# EAGLE design OSD Mixer (EAGLE 9.6.2)
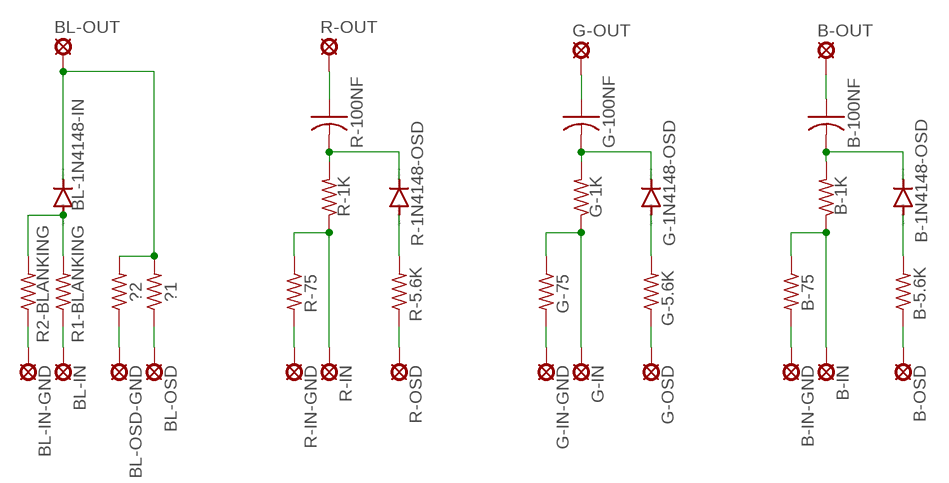
[diagram p0: schematic, sheet 1]

## Parts
?1  R-US_0204/2V  [0204V]
?2  R-US_0204/2V  [0204V]
B-1K  R-US_0204/2V  [0204V]
B-1N4148-OSD  1N4148DO35-7  [DO35-7]
B-5.6K  R-US_0204/2V  [0204V]
B-75  R-US_0204/2V  [0204V]
B-100NF  C-US025-024X044  [C025-024X044]
B-IN  SE14  [SE14]
B-IN-GND  SE14  [SE14]
B-OSD  SE14  [SE14]
B-OUT  SE14  [SE14]
BL-1N4148-IN  1N4148DO35-7  [DO35-7]
BL-IN  SE14  [SE14]
BL-IN-GND  SE14  [SE14]
BL-OSD  SE14  [SE14]
BL-OSD-GND  SE14  [SE14]
BL-OUT  SE14  [SE14]
G-1K  R-US_0204/2V  [0204V]
G-1N4148-OSD  1N4148DO35-7  [DO35-7]
G-5.6K  R-US_0204/2V  [0204V]
G-75  R-US_0204/2V  [0204V]
G-100NF  C-US025-024X044  [C025-024X044]
G-IN  SE14  [SE14]
G-IN-GND  SE14  [SE14]
G-OSD  SE14  [SE14]
G-OUT  SE14  [SE14]
R1-BLANKING  R-US_0204/2V  [0204V]
R2-BLANKING  R-US_0204/2V  [0204V]
R-1K  R-US_0204/2V  [0204V]
R-1N4148-OSD  1N4148DO35-7  [DO35-7]
R-5.6K  R-US_0204/2V  [0204V]
R-75  R-US_0204/2V  [0204V]
R-100NF  C-US025-024X044  [C025-024X044]
R-IN  SE14  [SE14]
R-IN-GND  SE14  [SE14]
R-OSD  SE14  [SE14]
R-OUT  SE14  [SE14]

## Nets
N$1: G-100NF.1 G-OUT.MP
N$2: BL-IN-GND.MP R2-BLANKING.1
N$3: G-1K.2 G-1N4148-OSD.C G-100NF.2
N$4: G-75.2 G-IN-GND.MP
N$5: G-1K.1 G-75.1 G-IN.MP
N$6: G-5.6K.1 G-OSD.MP
N$7: G-1N4148-OSD.A G-5.6K.2
N$8: R-100NF.1 R-OUT.MP
N$10: R-75.2 R-IN-GND.MP
N$11: BL-IN.MP R1-BLANKING.1
N$12: ?2.1 BL-OSD-GND.MP
N$13: ?1.1 BL-OSD.MP
N$14: R-1K.1 R-75.1 R-IN.MP
N$15: R-5.6K.1 R-OSD.MP
N$16: R-1N4148-OSD.A R-5.6K.2
N$17: BL-1N4148-IN.A R1-BLANKING.2 R2-BLANKING.2
N$18: B-75.2 B-IN-GND.MP
N$19: B-1K.1 B-75.1 B-IN.MP
N$20: B-5.6K.1 B-OSD.MP
N$21: ?1.2 ?2.2 BL-1N4148-IN.C BL-OUT.MP
N$22: B-1N4148-OSD.A B-5.6K.2
N$23: B-1K.2 B-1N4148-OSD.C B-100NF.2
N$24: B-100NF.1 B-OUT.MP
N$25: R-1K.2 R-1N4148-OSD.C R-100NF.2

## Library data of the parts
?1 ?2 B-1K B-5.6K B-75 G-1K G-5.6K G-75 R1-BLANKING R2-BLANKING R-1K R-5.6K R-75 = rcl:R-US_: RESISTOR, American symbol; SPICEPREFIX: R
B-1N4148-OSD BL-1N4148-IN G-1N4148-OSD R-1N4148-OSD = diode:1N4148: DIODE high speed (Philips)
B-100NF G-100NF R-100NF = rcl:C-US: CAPACITOR, American symbol; SPICEPREFIX: C
B-IN B-IN-GND B-OSD B-OUT BL-IN BL-IN-GND BL-OSD BL-OSD-GND BL-OUT G-IN G-IN-GND G-OSD G-OUT R-IN R-IN-GND R-OSD R-OUT = solpad:SE14: SOLDER PAD E1553, drill 1,4mm, distributor Buerklin, 07F820

## Board
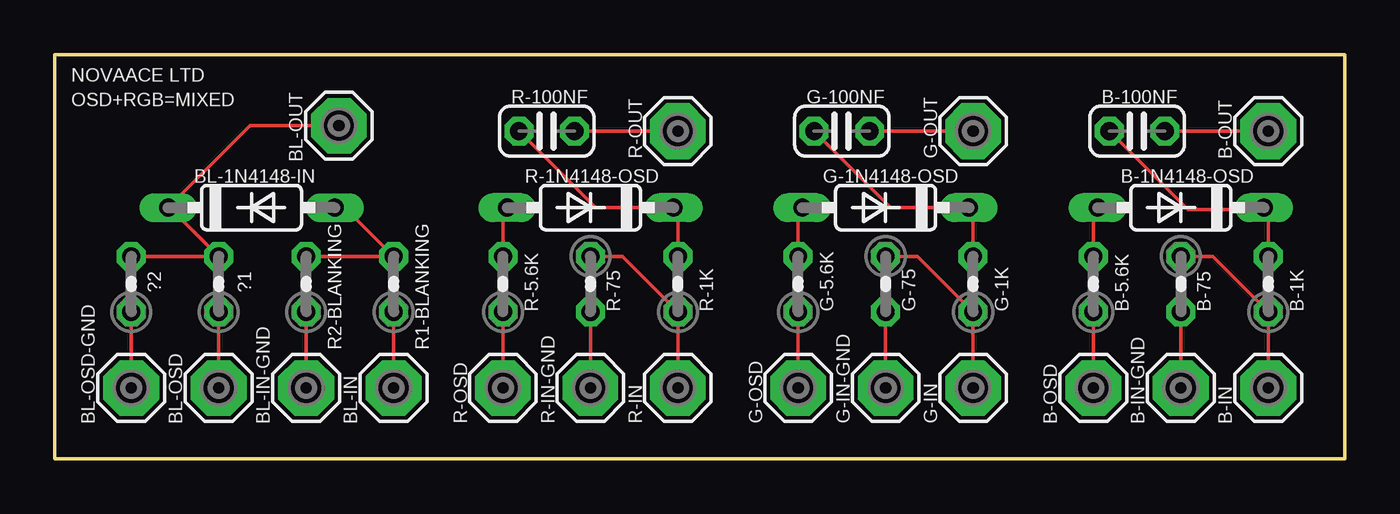
[diagram p1: board, top side]

Size 59 x 18.5 mm. Coordinates in mm from the lower left corner, seen from the top.
Outline: 0,0 0,18.5 59,18.5 59,0 0,0
Copper layers (1*16): Top 0.035mm / dielectric 1.5mm / Bottom 0.035mm
Design rules "default": minimum track width 6mil, minimum drill 0.35mm, track to track 6mil, track to pad 6mil, pad to pad 6mil, via to via 6mil, smd to smd 6mil, copper to edge 40mil, drill to drill 6mil, minimum pad ring 10mil, minimum via ring 8mil, stop-mask expansion 4mil, vias tented up to drill 0mil, thermal gap 10mil

### Footprints (pad centres in the part's own frame; a part is rotated, then mirrored left to right if it is on the bottom)
0204V = drill 0.813 octagon: 1 -1.27,0; 2 1.27,0
DO35-7 = drill 0.813 long: A 3.81,0; C -3.81,0
C025-024X044 = drill 0.813 octagon: 1 -1.27,0; 2 1.27,0
SE14 = drill 1.397 pad 2.54 octagon: MP 0,0

### Placement (x,y rotation side)
?1  7.5,8 90 top
?2  3.5,8 90 top
B-1K  55.5,8 90 top
B-1N4148-OSD  51.5,11.5 180 top
B-5.6K  47.5,8 90 top
B-75  51.5,8 270 top
B-100NF  49.5,15 180 top
B-IN  55.5,3.25 0 top
B-IN-GND  51.5,3.25 0 top
B-OSD  47.5,3.25 0 top
B-OUT  55.5,15 0 top
BL-1N4148-IN  9,11.5 0 top
BL-IN  15.5,3.25 0 top
BL-IN-GND  11.5,3.25 0 top
BL-OSD  7.5,3.25 0 top
BL-OSD-GND  3.5,3.25 0 top
BL-OUT  13,15.25 0 top
G-1K  42,8 90 top
G-1N4148-OSD  38,11.5 180 top
G-5.6K  34,8 90 top
G-75  38,8 270 top
G-100NF  36,15 180 top
G-IN  42,3.25 0 top
G-IN-GND  38,3.25 0 top
G-OSD  34,3.25 0 top
G-OUT  42,15 0 top
R1-BLANKING  15.5,8 90 top
R2-BLANKING  11.5,8 90 top
R-1K  28.5,8 90 top
R-1N4148-OSD  24.5,11.5 180 top
R-5.6K  20.5,8 90 top
R-75  24.5,8 270 top
R-100NF  22.5,15 180 top
R-IN  28.5,3.25 0 top
R-IN-GND  24.5,3.25 0 top
R-OSD  20.5,3.25 0 top
R-OUT  28.5,15 0 top

### Tracks (layer width: path | path; a pad name or v marks a point on that pad's centre or on a via)
N$1
  Top 0.152: G-100NF.1 G-OUT.MP
N$2
  Top 0.152: R2-BLANKING.1 BL-IN-GND.MP
N$3
  Top 0.152: G-1K.2 42,11.31 G-1N4148-OSD.C 38.23,11.5 G-100NF.2
N$4
  Top 0.152: G-IN-GND.MP G-75.2
N$5
  Top 0.152: G-IN.MP G-1K.1 39.46,9.27 G-75.1
N$6
  Top 0.152: G-OSD.MP G-5.6K.1
N$7
  Top 0.152: G-5.6K.2 34,11.31 G-1N4148-OSD.A
N$8
  Top 0.152: R-100NF.1 R-OUT.MP
N$10
  Top 0.152: R-IN-GND.MP R-75.2
N$11
  Top 0.152: R1-BLANKING.1 BL-IN.MP
N$12
  Top 0.152: ?2.1 BL-OSD-GND.MP
N$13
  Top 0.152: ?1.1 BL-OSD.MP
N$14
  Top 0.152: R-IN.MP R-1K.1 25.96,9.27 R-75.1
N$15
  Top 0.152: R-OSD.MP R-5.6K.1
N$16
  Top 0.152: R-5.6K.2 20.5,11.31 R-1N4148-OSD.A
N$17
  Top 0.152: R2-BLANKING.2 R1-BLANKING.2 13.27,11.5 BL-1N4148-IN.A
N$18
  Top 0.152: B-IN-GND.MP B-75.2
N$19
  Top 0.152: B-IN.MP B-1K.1 52.96,9.27 B-75.1
N$20
  Top 0.152: B-OSD.MP B-5.6K.1
N$21
  Top 0.152: ?2.2 ?1.2 5.27,11.5 BL-1N4148-IN.C 8.94,15.25 BL-OUT.MP
N$22
  Top 0.152: B-5.6K.2 47.5,11.31 B-1N4148-OSD.A
N$23
  Top 0.152: B-1K.2 55.5,11.31 55.41,11.4 | 55.41,11.4 B-1N4148-OSD.C | B-100NF.2 51.83,11.4 55.41,11.4
N$24
  Top 0.152: B-100NF.1 B-OUT.MP
N$25
  Top 0.152: R-1K.2 28.5,11.31 R-1N4148-OSD.C 24.73,11.5 R-100NF.2

### Text on the board
tNames: NOVAACE LTD | OSD+RGB=MIXED
bNames: POINT TOWARDS MOTHERBOARD